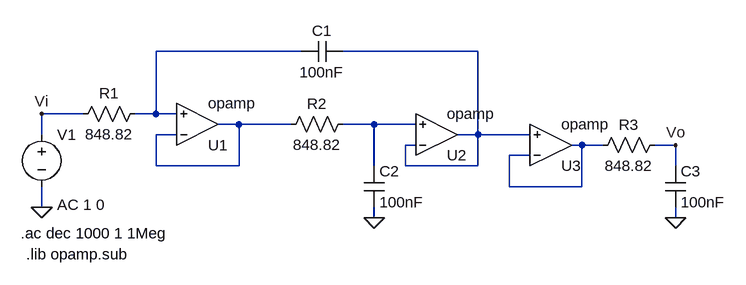
[diagram p0: schematic TS3_Bic_DesN.asc]
TS3_Bic_DesN.asc, the LTspice schematic file:
Version 4
SHEET 1 948 680
WIRE 288 48 64 48
WIRE 560 48 352 48
WIRE -48 144 -112 144
WIRE 64 144 64 48
WIRE 64 144 32 144
WIRE 96 144 64 144
WIRE 192 160 160 160
WIRE 272 160 192 160
WIRE 400 160 352 160
WIRE 464 160 400 160
WIRE -112 176 -112 144
WIRE 96 176 64 176
WIRE 560 176 560 48
WIRE 560 176 528 176
WIRE 640 176 560 176
WIRE 464 192 448 192
WIRE 720 192 704 192
WIRE 752 192 720 192
WIRE 864 192 832 192
WIRE 640 208 608 208
WIRE 64 224 64 176
WIRE 192 224 192 160
WIRE 192 224 64 224
WIRE 400 224 400 160
WIRE 448 224 448 192
WIRE 560 224 560 176
WIRE 560 224 448 224
WIRE 864 224 864 192
WIRE 608 256 608 208
WIRE 720 256 720 192
WIRE 720 256 608 256
WIRE -112 288 -112 256
WIRE 400 304 400 288
WIRE 864 304 864 288
FLAG 400 304 0
FLAG 864 304 0
FLAG -112 288 0
FLAG 864 192 Vo
FLAG -112 144 Vi
SYMBOL res 48 128 R90
WINDOW 0 0 56 VBottom 2
WINDOW 3 32 56 VTop 2
SYMATTR InstName R1
SYMATTR Value 848.82
SYMBOL cap 352 32 R90
WINDOW 0 0 32 VBottom 2
WINDOW 3 32 32 VTop 2
SYMATTR InstName C1
SYMATTR Value 100nF
SYMBOL res 368 144 R90
WINDOW 0 0 56 VBottom 2
WINDOW 3 32 56 VTop 2
SYMATTR InstName R2
SYMATTR Value 848.82
SYMBOL cap 384 224 R0
SYMATTR InstName C2
SYMATTR Value 100nF
SYMBOL cap 848 224 R0
SYMATTR InstName C3
SYMATTR Value 100nF
SYMBOL res 848 176 R90
WINDOW 0 0 56 VBottom 2
WINDOW 3 32 56 VTop 2
SYMATTR InstName R3
SYMATTR Value 848.82
SYMBOL OpAmps\\opamp 128 224 M180
SYMATTR InstName U1
SYMBOL OpAmps\\opamp 496 240 M180
SYMATTR InstName U2
SYMBOL OpAmps\\opamp 672 256 M180
SYMATTR InstName U3
SYMBOL voltage -112 160 R0
WINDOW 123 24 124 Left 2
WINDOW 39 0 0 Left 0
SYMATTR Value2 AC 1 0
SYMATTR InstName V1
SYMATTR Value ""
TEXT -144 328 Left 2 !.ac dec 1000 1 1Meg
TEXT -136 360 Left 2 !.lib opamp.sub

The netlist it stands for:
* TS3_Bic_DesN.asc
R1 N001 Vi 848.82
C1 N002 N001 100nF
R2 N004 N003 848.82
C2 N004 0 100nF
C3 Vo 0 100nF
R3 Vo N005 848.82
XU1 N003 N001 N003 opamp Aol=100K GBW=10Meg  ; pins invin noninvin out
XU2 N002 N004 N002 opamp Aol=100K GBW=10Meg  ; pins invin noninvin out
XU3 N005 N002 N005 opamp Aol=100K GBW=10Meg  ; pins invin noninvin out
V1 Vi 0 AC 1 0
.ac dec 1000 1 1Meg
.lib opamp.sub
.backanno
.end